# Altium schematic sheet Sheet2.SchDoc
size A4
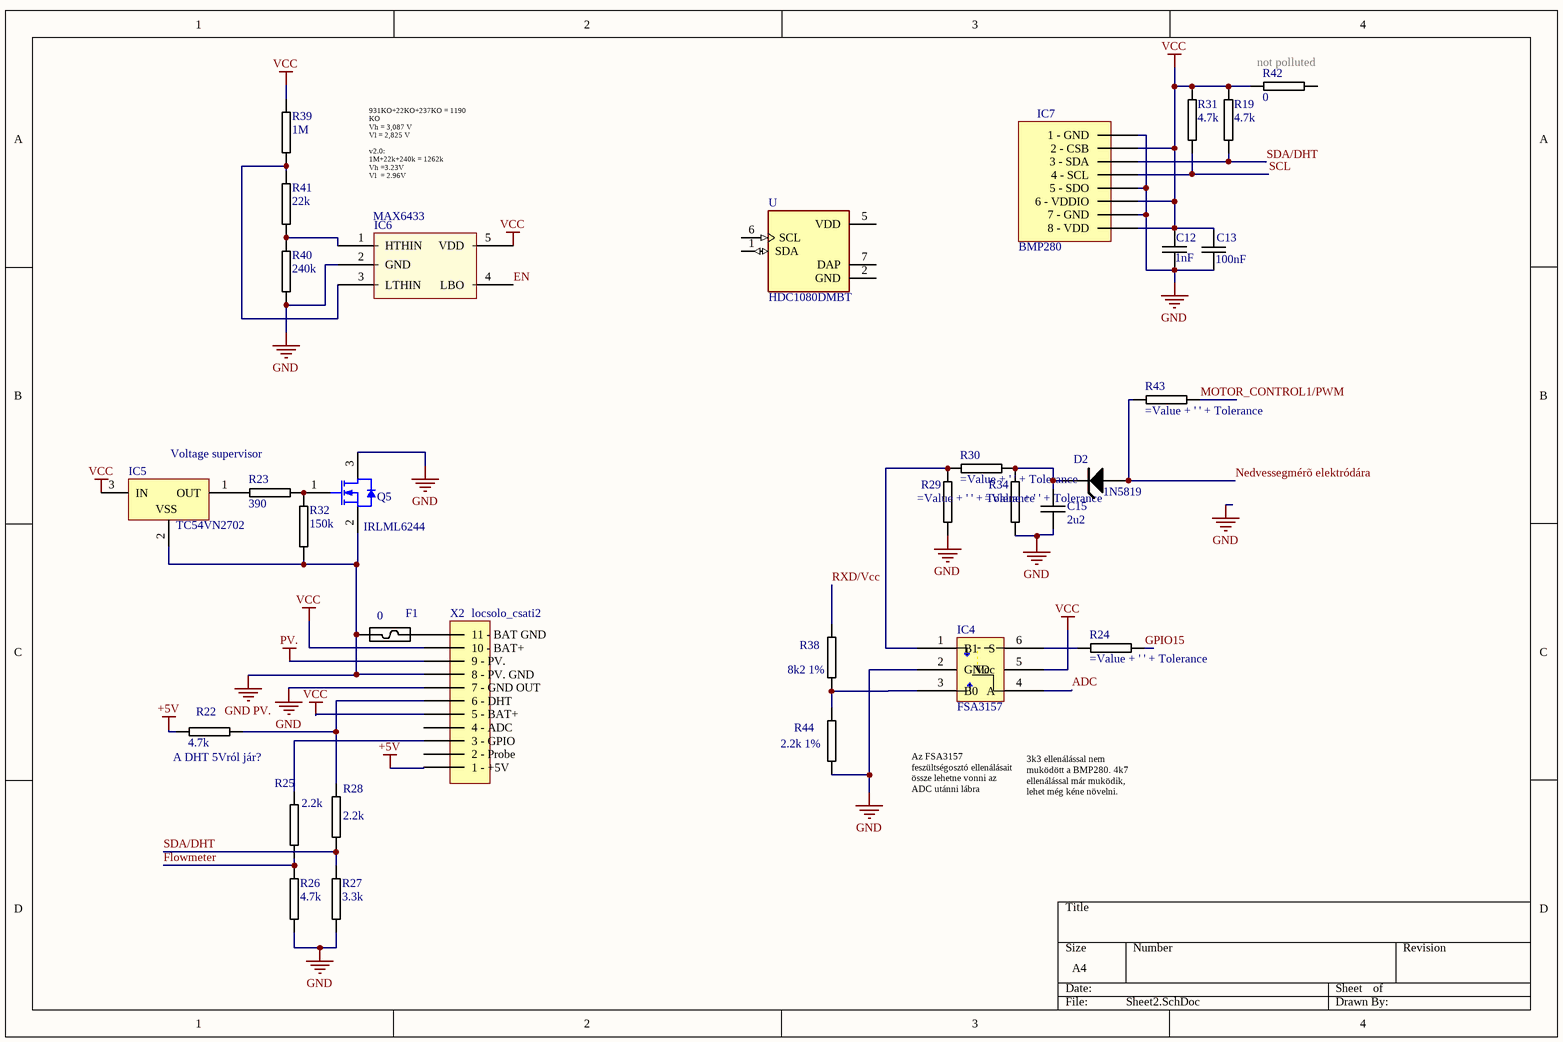
[diagram p0: Sheet2.SchDoc]

## Parts
C12  1nF  [0805C-GENERIC]
C13  100nF  [0805C-GENERIC]
C15  2u2  [0805C-GENERIC]
D2  1N5819  [sod-123]
F1  0  [Fuse_1206]
IC4  FSA3157  [SC70-6]
IC5  TC54VN2702  [SOT-23A-CB3_L]
IC6  MAX6433  [SOT23-5]
IC7  BMP280  [BMP280]
Q5  IRLML6244  [INF-PG-SOT23_N]
R19  4.7k  [0805R-4K7]
R22  4.7k  [0805R-4K7]
R23  390  [0805R-470]
R24  (no value)  [0805R-390]
R25  2.2k  [0805R-4K7]
R26  4.7k  [0805R-4K7]
R27  3.3k  [0805R-4K7]
R28  2.2k  [0805R-4K7]
R29  (no value)  [0805R-100]
R30  (no value)  [0805R-100]
R31  4.7k  [0805R-4K7]
R32  150k  [0805R-150K]
R34  (no value)  [0805R-100]
R38  8k2 1%  [0805R-4K7]
R39  1M  [0805R-TBD]
R40  240k  [0805R-TBD]
R41  22k  [0805R-TBD]
R42  0  [0805R-TBD]
R43  (no value)  [0805R-100]
R44  2.2k 1%  [0805R-1K]
U  HDC1080DMBT  [SON100P300X300X80-7N]
X2  locsolo_csati2  [locsolo_csati2]

## Nets
+5V: R22.1 X2.1(1_-_+5V)
GND: C12.2 C13.2 C15.2 IC4.2(GND) IC6.2(GND) IC7.1(1_-_GND) IC7.5(5_-_SDO) IC7.7(7_-_GND) Q5.3(DRAIN) R26.1 R27.1 R29.1 R34.1 R40.2 R44.1 X2.7(7_-_GND_OUT)
GND PV.: F1.1 IC5.2(VSS) Q5.2(SOURCE) R32.2 X2.8(8_-_PV._GND)
PV.: X2.9(9_-_PV.)
VCC: C12.1 C13.1 IC4.5(Vcc) IC5.3(IN) IC6.5(VDD) IC7.2(2_-_CSB) IC7.6(6_-_VDDIO) IC7.8(8_-_VDD) R19.2 R31.2 R39.2 R42.1 X2.5(5_-_BAT+) X2.10(10_-_BAT+)
ADC: IC4.4(A)
EN: IC6.4(LBO)
Flowmeter: R25.1 R26.2
GPIO15: R24.1
MOTOR_CONTROL1/PWM: R43.1
Nedvessegmérõ elektródára: D2.A R43.2
RXD/Vcc: R38.1
SCL: IC7.4(4_-_SCL) R31.1
SDA/DHT: IC7.3(3_-_SDA) R19.1 R27.2 R28.1
NetC15_1: C15.1 D2.K R30.1 R34.2
NetF1_2: F1.2 X2.11(11_-_BAT_GND)
NetIC4_1: IC4.1(B1) R29.2 R30.2
NetIC4_3: IC4.3(B0) R38.2 R44.2
NetIC4_6: IC4.6(S) R24.2
NetIC5_1: IC5.1(OUT) R23.1
NetIC6_1: IC6.1(HTHIN) R40.1 R41.2
NetIC6_3: IC6.3(LTHIN) R39.1 R41.1
NetQ5_1: Q5.1(GATE) R23.2 R32.1
NetR22_2: R22.2 R28.2 X2.6(6_-_DHT)
NetR25_2: R25.2 X2.3(3_-_GPIO)

Not connected (* = marked no-connect by the designer): R42 2; U 1(SDA) 2(GND) 5(VDD) 6(SCL) 7(DAP); X2 2(2_-_Probe) 4(4_-_ADC)

## Notes on the sheet
- (near R42) not polluted
- 931KO+22KO+237KO = 1190 KO
  Vh = 3,087 V
  Vl = 2,825 V
  v2.0:
  1M+22k+240k = 1262k
  Vh =3.23V
  Vl  = 2.96V
- Voltage supervisor
- (near R22) A DHT 5Vról jár?
- Az FSA3157 feszültségosztó ellenálásait össze lehetne vonni az ADC utánni lábra
- 3k3 ellenálással nem muködött a BMP280. 4k7 ellenálással már muködik, lehet még kéne növelni. Jelenleg a Lipoli feszültségérol táplálom és nincs bekötve a 4k7 ellenálás mert bizonytalan volta BMP280.

## Library data of the parts
C12 = C0805-GENERIC: 100nF; Value: 1nF
C13 = C0805-GENERIC: Value: 100nF
C15 = 0805C-2U2-6V3-X5R-PAN: CAPACITOR 0805 CERAMIC; Manufacturer Part Number: ECJ-1VB0J225K; Manufacturer: Panasonic - ECG; Reel: C7; Value: 2.2uF; Supplier 1: Digi-Key; Supplier Part Number 1: PCC2273TR-ND
D2 = BZT52C5V6: 1N5819 SOD123; Supplier 1: Digi-Key; Supplier Part Number 1: BZT52C5V6-FDITR-ND; Part Number: 1N5819
F1 = Fuse: Alternative: 0
IC5 = TC54VN2702ECB713: 1µA Voltage Detector, Open-Drain Output, 2.7V, 3-Pin SOT-23A, Industrial Temperature, Tape and Reel; Published: 29-Jan-2009; DatasheetVersion: revH, Dec-2007; PackageVersion: revBB, Aug-2009; PackageReference: SOT-23A-CB3; Publisher: Altium Limited; PackageDescription: 3-Lead Plastic Small Outline Transistor (CB) [SOT-23A]; Supplier 1: Digi-Key; Supplier Part Number 1: TC54VN2702ECB71TR-ND; Supplier 2: Digi-Key; Supplier Part Number 2: TC54VN2702ECB71CT-ND; Supplier 3: Digi-Key; Supplier Part Number 3: TC54VN2702ECB71DKR-ND; Supplier 4: Farnell; Supplier Part Number 4: 1292289; ComponentLink1Description: Datasheet; ComponentLink1URL: http://ww1.microchip.com/downloads/en/DeviceDoc/21434h.pdf; ComponentLink2Description: Packaging Specification; ComponentLink2URL: http://www.microchip.com/stellent/groups/techpub_sg/documents/packagingspec/en012702.pdf; ComponentLink3Description: Microchip.com Home; ComponentLink3URL: http://www.microchip.com/; Part Number: TC54VN2702
IC6 = MAX6433-MAX6435: Part Number: MAX6433
Q5 = BSS806N: N-Channel OptiMOS 2 Small-Signal-Transistor, 20 V VDS, 2.3 A ID, -55 to 150 degC, PG-SOT23, Reel, Green; Manufacturer: Infineon; Green: TRUE; ID (max): 2.3 A; IDpuls (max): 9.3 A; Ptot (max): 0.5 W; QG: 1.7 nC; RDS (on) (max): 57 mOhm; RDS (on) (max) (@1.8V): 82 mOhm; RthJA (max): 250 K/W; VDS (max): 20 V; VGS(th) (max): 0.75 V; VGS(th) (min): 0.3 V; DatasheetVersion: Rev. 2.3; PackageVersion: Apr-08; PackageReference: PG-SOT23; PackageDescription: 3-Pin Small Outline Transistor Package, 2.9 x 1.3 mm Body, 0.95 mm Pitch; Halogen-free: TRUE; Packing: Reel; RDS (on) (max) (@2.5V): 57 mOhm; Mounting Technology: Surface Mount; PartNumber: BSS806N; ComponentLink1Description: Manufacturer URL; ComponentLink1URL: http://www.infineon.com/; ComponentLink2Description: Datasheet; ComponentLink2URL: http://www.infineon.com/dgdl/BSS806N_Rev2.3_.pdf?folderId=db3a3043156fd573011622e10b5c1f67&fileId=db3a304330f686060131185f0553451c; ComponentLink3Description: Package Specification; ComponentLink3URL: http://www.infineon.com/dgdl/SOT23-Package_Overview.pdf?folderId=db3a30431936bc4b0119532290053c66&fileId=db3a30431936bc4b0119533468123c85; Part Number: IRLML6244
R19 R25 R26 R31 R38 = 0805R-4K7: RESISTOR 0805 1/4 WATT THIN FILM; Reel: *
  R19 R26 R31: Value: 4.7k
  R25: Value: 2.2k
  R38: Value: 8k2; Tolerance: 1%
R22 R27 R28 = 0805R-4K7: RESISTOR 0805 1/4 WATT THIN FILM; Assembly: No; Reel: *
  R22: Value: 4.7k
  R27: Value: 3.3k
  R28: Value: 2.2k
R23 = 0805R-470: RESISTOR 0805 1/4 WATT THIN FILM; Reel: *; Value: 390
R24 = 0805R-390: RESISTOR 0805 1/4 WATT THIN FILM; Value: 390; Reel: *
R29 R43 = 0805R-100: RESISTOR 0805 1/4 WATT THIN FILM; Value: 100k; Reel: *
  R43: Part Number: *
R30 = 0805R-100: RESISTOR 0805 1/4 WATT THIN FILM; Value: 220k; Reel: *
R32 = 0805R-150K: RESISTOR 0805 1/4 WATT THIN FILM; Reel: *; Value: 150k
R34 = 0805R-100: RESISTOR 0805 1/4 WATT THIN FILM; Value: 510k; Reel: *
R39 = 0805R-TBD: RESISTOR 0805 VALUE TO BE DETERMINED; Alternative: 931k; Value: 1M
R40 = 0805R-TBD: RESISTOR 0805 VALUE TO BE DETERMINED; Alternative: 237k; Value: 240k
R41 = 0805R-TBD: RESISTOR 0805 VALUE TO BE DETERMINED; Value: 22k; Alternative: 22k
R42 = 0805R-TBD: RESISTOR 0805 VALUE TO BE DETERMINED; Assembly: No; Value: 0
R44 = 0805R-1K: RESISTOR 0805 1/4 WATT THIN FILM; Reel: *; Value: 2.2k; Tolerance: 1%
U = HDC1080DMBT: Humidity Temperature Sensor 0 ~ 100% RH IÂ²C Â±2% RH 15s Surface Mount; MF: Texas Instruments; Package: WDFN-6 Texas Instruments; Value: *; Price: None; MP: HDC1080DMBT; Availability: Unavailable; SnapEDA_Link: https://www.snapeda.com/parts/HDC1080DMBT/Texas%20Instruments/view-part/472820/?ref=snap
IC4 = FSA3157: Part Number: FSA3157
IC7 = BMP280: Part Number: BMP280